# Altium schematic sheet Power.SchDoc
size A4; SheetNumber: 2; SheetTotal: 6
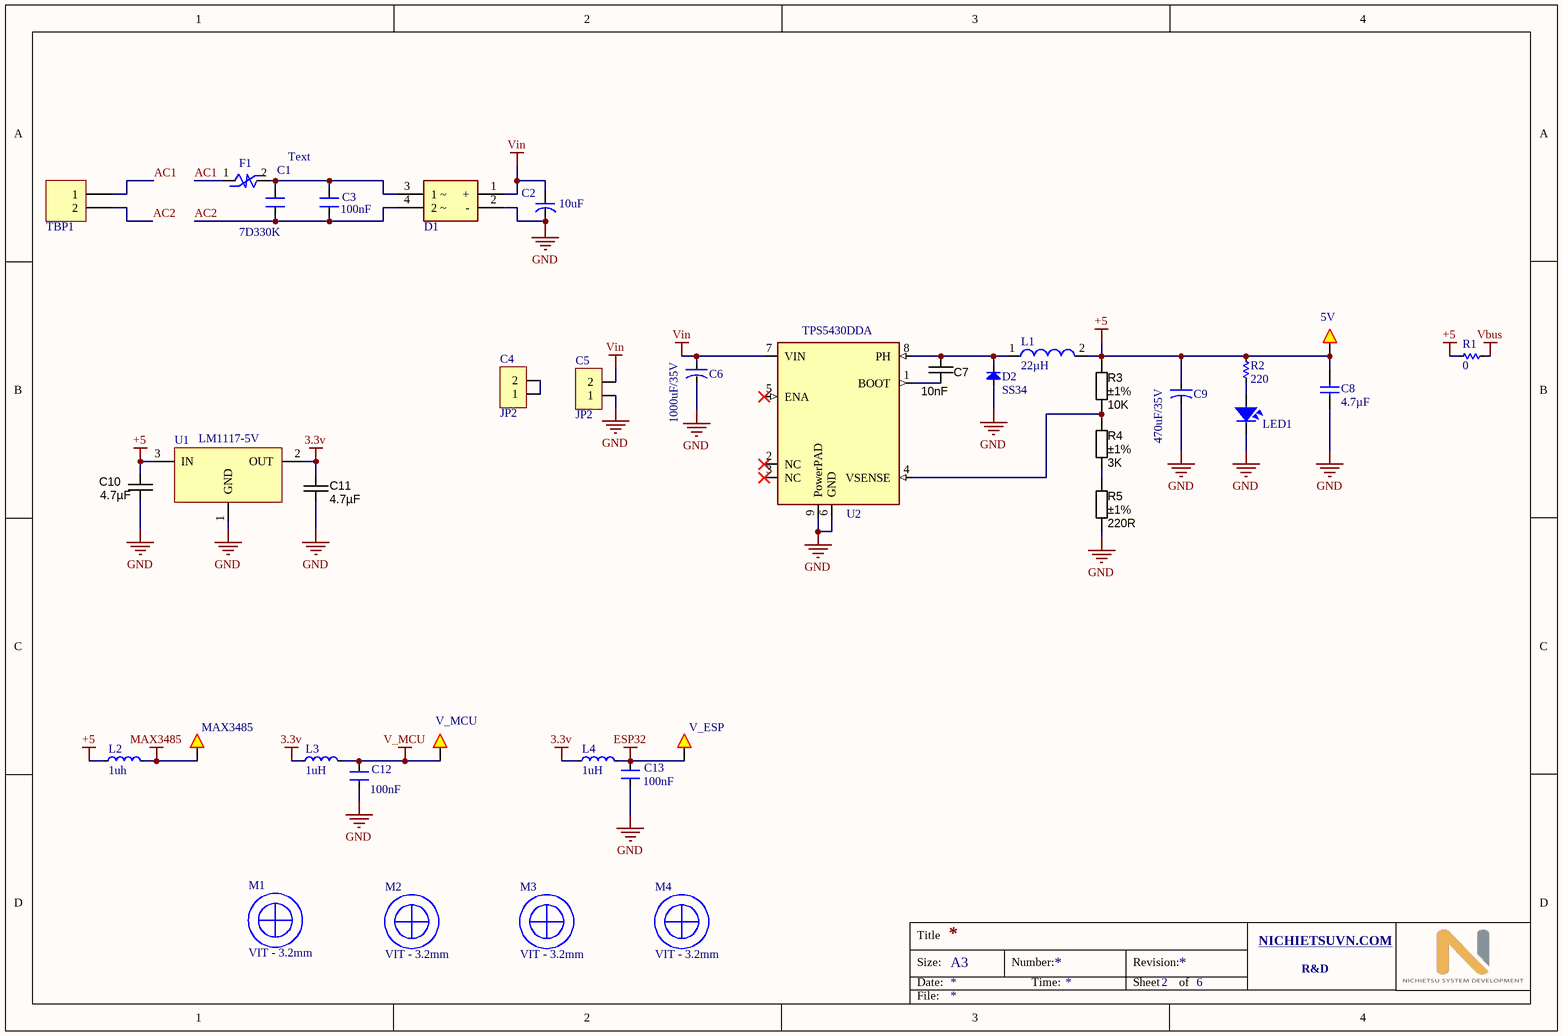
[diagram p0: Power.SchDoc]

## Parts
C1  7D330K  [CN2-G]
C2  10uF  [CN-SMD-0805]
C3  100nF  [CN1]
C4  JP2  [JP2-C1T]
C5  JP2  [JP2-C1T]
C6  1000uF/35V  [CA-ALU-5W]
C7  10nF  [CAPC1608X90N]
C8  4.7µF  [CAPC1608X06L]
C9  470uF/35V  [CA-ALU-5W]
C10  4.7µF  [CAPC2012X135N]
C11  4.7µF  [CAPC2012X135N]
C12  100nF  [CN-SMD-0603]
C13  100nF  [CN-SMD-0805]
Check1  5V  [SMD-2]
D1  MB6S  [MB6]  (value not drawn)
D2  SS34  [DIO-SMD-106]
F1  RUEF185  [RES-1WD]  (value not drawn)
L1  22µH  [IND_COIL_8D43]
L2  1uh  [INDC1608X06L]
L3  1uH  [INDC1608X06L]
L4  1uH  [INDC1608X06L]
LED1  LED  [LED-0805-Blue]  (value not drawn)
M1  VIT - 3.2mm  [VIT - 3.2MM_2]
M2  VIT - 3.2mm  [VIT - 3.2MM_2]
M3  VIT - 3.2mm  [VIT - 3.2MM_2]
M4  VIT - 3.2mm  [VIT - 3.2MM_2]
R1  0  [RES-SMD-0603]
R2  220  [RES-SMD-0603]
R3  value 10K  Tolerance: ±1%  [RESC1608X55N]  (hidden comment: 10K_0603_1%)
R4  value 3K  Tolerance: ±1%  [RESC1608X55N]  (hidden comment: 3K_0603_0.5%)
R5  value 220R  Tolerance: ±1%  [RESC1608X55N]  (hidden comment: 220R_0603_1%)
TBP1  WE-Terminal Blocks Plugable Type 691322310002  [Terminal_Blocks_Pluggable_Socket__Right_Angle__3.81_mm_Pitch__2_Position]  (value not drawn)
U1  LM1117-5V  [SOT223]
U2  TPS5430DDA  [TPS5430]
V1  MAX3485  [SMD_1]
V2  V_MCU  [SMD_1]
V3  V_ESP  [SMD_1]

## Nets
3.3v: C11.2 L3.1 L4.1 U1.2(OUT)
+5: C8.2 C9.1 C10.2 Check1.1 L1.2 L2.1 R1.1 R2.1 R3.2 U1.3(IN)
ESP32: C13.1 L4.2 V3.1
GND: C2.2 C5.1 C6.2 C8.1 C9.2 C10.1 C11.1 C12.1 C13.2 D1.2(-) D2.1(A) LED1.2 R5.1 U1.1(GND) U2.6(GND) U2.9(PowerPAD)
MAX3485: L2.2 V1.1
V_MCU: C12.2 L3.2 V2.1
Vbus: R1.2
Vin: C2.1 C5.2 C6.1 D1.1(+) U2.7(VIN)
AC1: F1.1 TBP1.1
AC2: C1.1 C3.2 D1.4(2_~) TBP1.2
NetC1_2: C1.2 C3.1 D1.3(1_~) F1.2
NetC4_1: C4.1 C4.2
NetC7_1: C7.1 U2.1(BOOT)
NetC7_2: C7.2 D2.2(K) L1.1 U2.8(PH)
NetLED1_1: LED1.1 R2.2
NetR3_1: R3.1 R4.2 U2.4(VSENSE)
NetR4_1: R4.1 R5.2

Not connected (* = marked no-connect by the designer): U2 2(NC)* 3(NC)* 5(ENA)*

## Notes on the sheet
- Text
- Title
- Size:
- Date:
- A3
- Number:
- Time:
- Revision:
- Sheet
- of
- NICHIETSUVN.COM <http://NICHIETSUVN.COM>
- R&D
- File:

## Library data of the parts
C1 C3 C12 C13 = CN: Value: 33pF
C2 = CAP_1: capacitor tantalum, pol
C4 C5 = JP2: WR-PHD 2.54 mm Angled Socket Header; Manufacturer: W¨¹rth Elektronik eiSos GmbH; partNo: 613002143121; ComponentLink1 Description: Manufacturer; ComponentLink2 Description: Datasheet; NoPins: 02; Created Date: 29 March 2013; ComponentLink1URL: http://www.we-online.com; ComponentLink2URL: http://katalog.we-online.de/em/datasheet/6130xx143121.pdf; Created by: Karrer Zheng
C6 C9 = CN-ALU-DIP: Capacitor (Semiconductor SIM Model); Value: 104; LatestRevisionDate: 17-Jul-2002; LatestRevisionNote: Re-released for DXP Platform.; PackageReference: C1206; Publisher: Altium Limited
C7 = CAPC_10000pF_0603_50V_10%: 10000pF ±10% 50V Ceramic Capacitor X7R 0603 (1608 Metric); Manufacturer 1: TDK Corporation; Manufacturer Part Number 1: CGA3E2X7R1H103K080AA; Pcs 2: 10; Tolerance: ±10%; Operating Temperature: -55°C ~ 125°C; Package / Case: 0603 (1608 Metric); Voltage - Rated: 50V; Ratings: AEC-Q200; Temperature Coefficient: X7R; Supplier Part Number 1: 445-5662-6-ND; Supplier 1: Digi-Key; Supplier 2: https://www.thegioiic.com; Supplier Part Number 2: https://www.thegioiic.com/products/tu-gom-0603-10nf-50v; Price 2: 1900; Value: 10nF
C8 = CAP_0603: Capacitor, X5R, ±10%; Part Number: C0603-4µ7; Note: 6.3V; Manufacturer: *; Manufacturer Part Number: *; LatestRevisionDate: 2009-11-23; Pin Count: 2; Publisher: Nordic Semiconductor; Published: 2009-05-08; Value: 4.7µF; Footprint Doc: 0603
C10 C11 = CAPC_4.7uF_0805_X7R_50V_10%: 4.7µF ±10% 50V Ceramic Capacitor X7R 0805 (2012 Metric); Manufacturer 1: TDK Corporation; Manufacturer Part Number: CGA4J1X7R1H475K125AE; Pcs 2: 1; Package / Case: 0805 (2012 metric); Tolerance: ±10%; Voltage - Rated: 50V; Temperature Coefficient: X7R; Ratings: AEC-Q200; Operating Temperature: -55°C ~ 125°C; Supplier 1: Digi-Key; Supplier Part Number 1: 445-181410-6-ND; Supplier 2: https://www.thegioiic.com; Supplier Part Number 2: https://www.thegioiic.com/products/tu-gom-0805-4-7uf-50v; Price 2: 680; Value: 4.7µF
Check1 V1-V3 = Test: WR-PHD 2.54 mm Angled Socket Header; Manufacturer: W¨¹rth Elektronik eiSos GmbH; partNo: 613002143121; ComponentLink1 Description: Manufacturer; ComponentLink2 Description: Datasheet; NoPins: 02; Created Date: 29 March 2013; ComponentLink1URL: http://www.we-online.com; ComponentLink2URL: http://katalog.we-online.de/em/datasheet/6130xx143121.pdf; Created by: Karrer Zheng
D2 = Diode SMD: Default Diode; Code - JEDEC: DO-214-AB; Value: 1N5007; Published: 8-Jun-2000; Revision: July-2002: Re-released for DXP Platform.; Publisher: Altium Limited
L1 = INDC_SMD_22uH_8D43: 22µH Shielded Wirewound Inductor 950mA 380mOhm Max Nonstandard; Manufacturer 1: Yageo; Current Rating (Amps): 3.25 A; Ratings: None AEC-Q200; Pcs 2: 1; Supplier 1: Digi-Key; Operating Temperature: -40°C ~ 125°C; Value: 22µH; Supplier 2: https://www.thegioiic.com/; Supplier Part Number 2: https://www.thegioiic.com/products/cuon-cam-dan-smd-8d43-220-22uh-3-25a; Price 2: 2000
L2-L4 = IND_0603: Chip inductor, IDC,min = 50 mA, ±20%; Part Number: L0603-10µ; Value: 10µH; LatestRevisionDate: 2012-09-19; Pin Count: 2; Publisher: Nordic Semiconductor; Published: 2010-02-24; Footprint Doc: 0603
LED1 = LED SMD: Value: LED 3 - 5 ly 2 Colour
R1 R2 = Res-SMD: Resistor; Manufacturer: Generic Components; Class: Passive; Published: 08/06/2000; Publisher: Altium Hobart Technology Centre
R3 = RES_10K_0603_1%: 10 kOhms ±1% 0.1W, 1/10W Chip Resistor 0603 (1608 Metric) Anti-Sulfur, Automotive AEC-Q200, Moisture Resistant Thin Film; Manufacturer: Stackpole Electronics Inc; Manufacturer Part Number: RMCF0603FT10K0; Temperature Coefficient: ±100ppm/°C; Pcs 2: 50; Package / Case: 0603 (1608 Metric); Power (Watts): 1/10W; Supplier 1: Digi-Key; Supplier Part Number 1: RMCF0603FT10K0DKR-ND; Ratings: Automotive AEC-Q200; Operating Temperature: -55°C ~ 155°C; Supplier 2: www.thegioiic.com; Supplier Part Number 2: https://www.thegioiic.com/products/dien-tro-10-kohm-0603-1; Price 2: 2000
R4 = RES_3K_0603_1%: 3 kOhms ±1% 0.1W, 1/10W Chip Resistor 0603 (1608 Metric) Automotive AEC-Q200 Thick Film; Manufacturer: Stackpole Electronics Inc; Manufacturer Part Number: RMCF0603FT3K00; Temperature Coefficient: ±100ppm/°C; Pcs 2: 50; Package / Case: 0603 (1608 Metric); Power (Watts): 1/10W; Supplier 1: Digi-Key; Supplier Part Number 1: RMCF0603FT3K00DKR-ND; Ratings: AEC-Q200; Supplier Part Number 2: https://www.thegioiic.com/products/dien-tro-3-kohm-0603-1; Supplier 2: www.thegioiic.com; Operating Temperature: -55°C ~ 155°C; Price 2: 2000
R5 = RES_220R_0603_1%: 220 Ohms ±1% 0.1W, 1/10W Chip Resistor 0603 (1608 Metric) Automotive AEC-Q200 Thick Film; Manufacturer: Stackpole Electronics Inc; Manufacturer Part Number: RMCF0603FT220R; Temperature Coefficient: ±100ppm/°C; Pcs 2: 50; Package / Case: 0603 (1608 Metric); Ratings: AEC-Q200; Supplier 1: Digi-Key; Supplier Part Number 1: RMCF0603FT220RDKR-ND; Power (Watts): 0.1W, 1/10W; Operating Temperature: -55°C ~ 155°C; Composition: Thick Film; Supplier 2: www.thegioiic.com; Supplier Part Number 2: https://www.thegioiic.com/products/dien-tro-220-ohm-0603-1; Price 2: 2000
TBP1 = Terminal_Blocks_Pluggable_Socket__Right_Angle__3.81_mm_Pitch__2_Position: WR-TBL Terminal block - serie 322 - 3.81 mm; Manufacturer 1: W¨¹rth Elektronik eiSos GmbH; ComponentLink1 Description: Manufacturer; ComponentLink2 Description: Datasheet; NoPins: 02; Pcs 2: 1; ComponentLink1URL: http://www.we-online.com; ComponentLink2URL: http://katalog.we-online.de/em/datasheet/6913223100xx.pdf; Supplier 1: Digi-Key; Supplier Part Number 1: *; Supplier 2: https://www.thegioiic.com; Manufacturer Part Number 1: 691322310002; Supplier Part Number 2: https://www.thegioiic.com/products/kf-3-81-2-r-terminal-block-plug-in-han-pcb-2-chan-cong-3-81mm; Price 2: 2000
U1 = LM1117: 800mA Low-Dropout Linear Regulator; Creator: Nguyen Ba Bien; Website: http://group3i.net